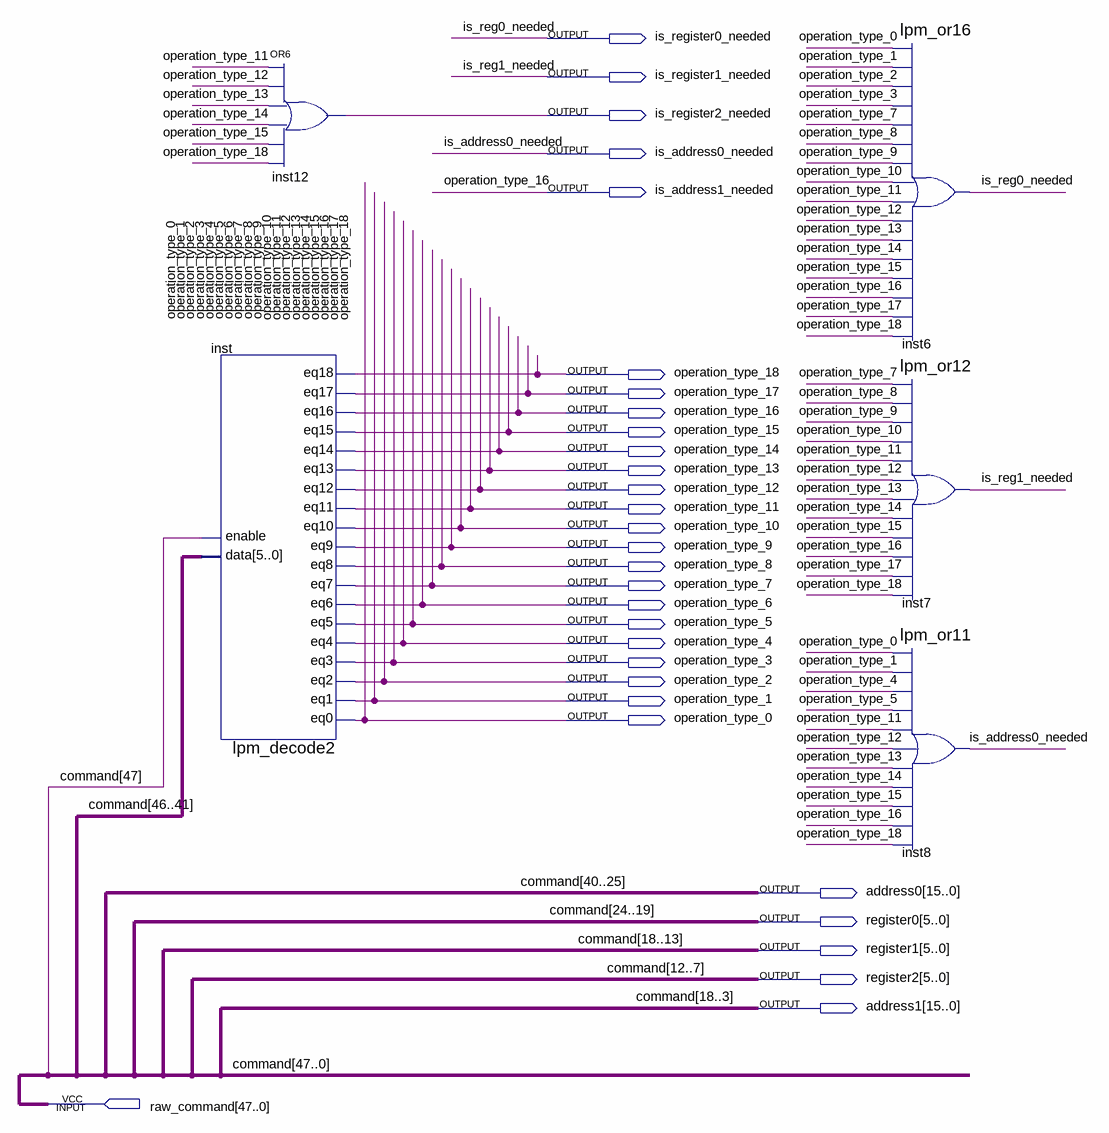
[diagram p0: schematic sheet]
// Quartus schematic CommandParserBlock.bdf as structural Verilog: 5 symbols, 30 pins
module CommandParserBlock (
  input  [47:0] raw_command,
  output is_register0_needed,
  output is_register1_needed,
  output is_register2_needed,
  output is_address0_needed,
  output is_address1_needed,
  output operation_type_18,
  output operation_type_17,
  output operation_type_16,
  output operation_type_15,
  output operation_type_14,
  output operation_type_13,
  output operation_type_12,
  output operation_type_11,
  output operation_type_10,
  output operation_type_9,
  output operation_type_8,
  output operation_type_7,
  output operation_type_6,
  output operation_type_5,
  output operation_type_4,
  output operation_type_3,
  output operation_type_2,
  output operation_type_1,
  output operation_type_0,
  output [15:0] address0,
  output [5:0] register0,
  output [5:0] register1,
  output [5:0] register2,
  output [15:0] address1
);

  lpm_decode2 inst (
    .data(raw_command[46:41]), .enable(raw_command[47]), .eq0(operation_type_0), .eq1(operation_type_1),
    .eq2(operation_type_2), .eq3(operation_type_3), .eq4(operation_type_4), .eq5(operation_type_5),
    .eq6(operation_type_6), .eq7(operation_type_7), .eq8(operation_type_8), .eq9(operation_type_9),
    .eq10(operation_type_10), .eq11(operation_type_11), .eq12(operation_type_12), .eq13(operation_type_13),
    .eq14(operation_type_14), .eq15(operation_type_15), .eq16(is_address1_needed), .eq17(operation_type_17),
    .eq18(operation_type_18));
  or inst12 (is_register2_needed, operation_type_11, operation_type_12, operation_type_13, operation_type_14, operation_type_15, operation_type_18);
  lpm_or16 inst6 (
    .data0(operation_type_0), .data1(operation_type_1), .data2(operation_type_2), .data3(operation_type_3),
    .data4(operation_type_7), .data5(operation_type_8), .data6(operation_type_9), .data7(operation_type_10),
    .data8(operation_type_11), .data9(operation_type_12), .data10(operation_type_13),
    .data11(operation_type_14), .data12(operation_type_15), .data13(is_address1_needed),
    .data14(operation_type_17), .data15(operation_type_18), .result(is_register0_needed));
  lpm_or12 inst7 (
    .data0(operation_type_7), .data1(operation_type_8), .data2(operation_type_9), .data3(operation_type_10),
    .data4(operation_type_11), .data5(operation_type_12), .data6(operation_type_13),
    .data7(operation_type_14), .data8(operation_type_15), .data9(is_address1_needed),
    .data10(operation_type_17), .data11(operation_type_18), .result(is_register1_needed));
  lpm_or11 inst8 (
    .data0(operation_type_0), .data1(operation_type_1), .data2(operation_type_4), .data3(operation_type_5),
    .data4(operation_type_11), .data5(operation_type_12), .data6(operation_type_13),
    .data7(operation_type_14), .data8(operation_type_15), .data9(is_address1_needed),
    .data10(operation_type_18), .result(is_address0_needed));

  assign address0 = raw_command[40:25];
  assign address1 = raw_command[18:3];
  assign operation_type_16 = is_address1_needed;
  assign register0 = raw_command[24:19];
  assign register1 = raw_command[18:13];
  assign register2 = raw_command[12:7];

  // Other names for the same wires on the sheet: command[47:0] = raw_command; is_reg0_needed = is_register0_needed;
  //   is_reg1_needed = is_register1_needed
endmodule
